# Altium schematic sheet Sheet2.SchDoc
size Letter; SheetNumber: 1; SheetTotal: 1; SPICEModelCacheTXCXQLUS: <root> / <DocumentId>TXCXQLUS</DocumentId> / <CacheFrame Number="0"> / <Model Name="led1" Kind="MDL"> / <Text>*Typ RED GaAs LED: Vf=1.7V Vr=4V If=40mA trr=3uS / *LED Pinout: 1=A, 2=K / .MODEL LED1 D (IS=93.2P RS=42M N=3.73 BV=4 IBV=10U / + CJO=2.97P VJ=.75 M=.333 TT=4.32U)</Text> / </Model> / </CacheFrame> / </root>
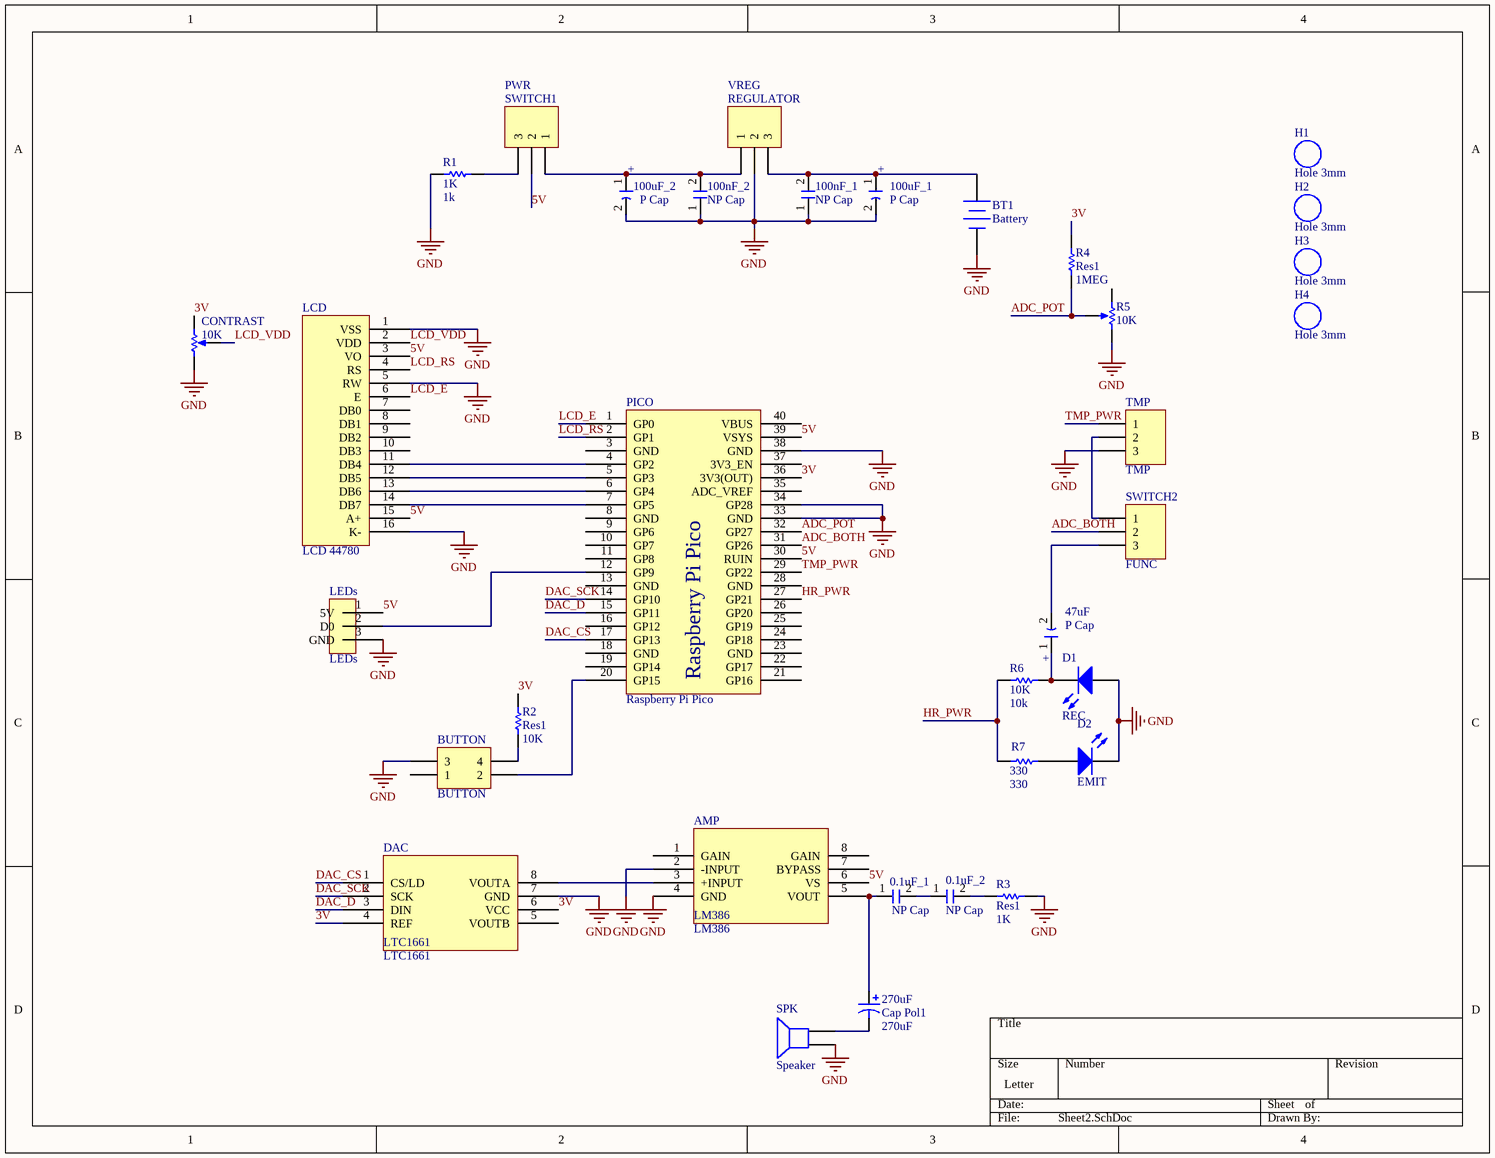
[diagram p0: Sheet2.SchDoc]

## Parts
0.1uF_1  NP Cap  [NP Cap - Small]
0.1uF_2  NP Cap  [NP Cap - Small]
47uF  P Cap  [P Cap - Small]
100nF_1  NP Cap  [NP Cap - Small]
100nF_2  NP Cap  [NP Cap - Small]
100uF_1  P Cap  [P Cap - Small]
100uF_2  P Cap  [P Cap - Small]
270uF  Cap Pol1  value 270uF  [RB7.6-15]
AMP  LM386  [8DIP]
BT1  Battery  [BAT-2]
BUTTON  BUTTON  [HDR2X2]
CONTRAST  value 10K  [POT OFFSET 200]  (hidden comment: RPot_3)
D1  REC  [LED-1]
D2  EMIT  [LED-1]
DAC  LTC1661  [8DIP]
H1  Hole 3mm  [Hole 3mm]
H2  Hole 3mm  [Hole 3mm]
H3  Hole 3mm  [Hole 3mm]
H4  Hole 3mm  [Hole 3mm]
LCD  LCD 44780  [OLED 16x2]
LEDs  LEDs  [RGB LED Port]
PICO  Raspberry Pi Pico  [Raspberry Pi Pico]
R1  1K  [AXIAL-0.3]
R2  Res1  value 10K  [AXIAL-0.3]
R3  Res1  value 1K  [AXIAL-0.3]
R4  Res1  value 1MEG  [AXIAL-0.3]
R5  value 10K  [POT OFFSET 200]  (hidden comment: RPot_3)
R6  10K  [AXIAL-0.3]
R7  330  [AXIAL-0.3]
REGULATOR  VREG  [HDR1X3]
SPK  Speaker  [PIN2]
SWITCH1  PWR  [HDR1X3]
SWITCH2  FUNC  [HDR1X3]
TMP  TMP  [HDR1X3]

## Nets
GND: 100nF_1.1 100nF_2.1 100uF_1.2 100uF_2.2 AMP.2(-INPUT) AMP.4(GND) BT1.2(-) BUTTON.3 CONTRAST.1(TOP) D1.1(A) D2.2(K) DAC.7(GND) LCD.1(VSS) LCD.5(RW) LCD.16(K-) LEDs.3(GND) PICO.33(GND) PICO.34(GP28) PICO.38(GND) R1.1 R3.1 R5.3(BOT) REGULATOR.2 SPK.2 TMP.3
3V: CONTRAST.3(BOT) DAC.4(REF) DAC.6(VCC) PICO.36(3V3(OUT)) R2.2 R4.1
5V: AMP.6(VS) LCD.3(VO) LCD.15(A+) LEDs.1(5V) PICO.30(RUIN) PICO.39(VSYS) SWITCH1.2
ADC_BOTH: PICO.31(GP26) SWITCH2.2
ADC_POT: PICO.32(GP27) R4.2 R5.2(TAP)
DAC_CS: DAC.1(CS/LD) PICO.17(GP13)
DAC_D: DAC.3(DIN) PICO.15(GP11)
DAC_SCK: DAC.2(SCK) PICO.14(GP10)
HR_PWR: PICO.27(GP21) R6.2 R7.2
LCD_E: LCD.6(E) PICO.1(GP0)
LCD_RS: LCD.4(RS) PICO.2(GP1)
LCD_VDD: CONTRAST.2(TAP) LCD.2(VDD)
TMP_PWR: PICO.29(GP22) TMP.1
Net0.1uF_1_1: 0.1uF_1.1 270uF.1 AMP.5(VOUT)
Net0.1uF_1_2: 0.1uF_1.2 0.1uF_2.1
Net0.1uF_2_2: 0.1uF_2.2 R3.2
Net47uF_1: 47uF.1 D1.2(K) R6.1
Net47uF_2: 47uF.2 SWITCH2.3
Net100nF_1_2: 100nF_1.2 100uF_1.1 BT1.1(+) REGULATOR.3
Net100nF_2_2: 100nF_2.2 100uF_2.1 REGULATOR.1 SWITCH1.1
Net270uF_2: 270uF.2 SPK.1
NetAMP_3: AMP.3(+INPUT) DAC.8(VOUTA)
NetBUTTON_2: BUTTON.2 PICO.20(GP15)
NetBUTTON_4: BUTTON.4 R2.1
NetD2_1: D2.1(A) R7.1
NetLCD_11: LCD.11(DB4) PICO.4(GP2)
NetLCD_12: LCD.12(DB5) PICO.5(GP3)
NetLCD_13: LCD.13(DB6) PICO.6(GP4)
NetLCD_14: LCD.14(DB7) PICO.7(GP5)
NetLEDs_2: LEDs.2(D0) PICO.12(GP9)
NetR1_2: R1.2 SWITCH1.3
NetSWITCH2_1: SWITCH2.1 TMP.2

Not connected (* = marked no-connect by the designer): AMP 1(GAIN) 7(BYPASS) 8(GAIN); BUTTON 1; DAC 5(VOUTB); LCD 7(DB0) 8(DB1) 9(DB2) 10(DB3); PICO 3(GND) 8(GND) 9(GP6) 10(GP7) 11(GP8) 13(GND) 16(GP12) 18(GND) 19(GP14) 21(GP16) 22(GP17) 23(GND) 24(GP18) 25(GP19) 26(GP20) 28(GND) 35(ADC_VREF) 37(3V3_EN) 40(VBUS); R5 1(TOP)

## Notes on the sheet
- (in symbol P Cap) +

## Library data of the parts
270uF = Cap Pol1: Polarized Capacitor (Radial); Published: 8-Jun-2000; LatestRevisionDate: 17-Jul-2002; LatestRevisionNote: Re-released for DXP Platform.; PackageReference: RB7.6-15; Publisher: Altium Limited; PackageDescription: Polarized Capacitor (Radial); 2 Leads
BT1 = Battery: Multicell Battery; Published: 24-Mar-1999; LatestRevisionDate: 17-Jul-2002; LatestRevisionNote: Re-released for DXP Platform.; PackageReference: BAT-2; Publisher: Altium Limited; PackageDescription: Battery; 2 Leads
BUTTON = Header 2X2: Header, 2-Pin, Dual row; LatestRevisionDate: 17-Jul-2002; LatestRevisionNote: Re-released for DXP Platform.; Publisher: Altium Limited
CONTRAST R5 = RPot: Potentiometer; Sim Note: Enter the Resistance value and the set point into parameter fields.; Set Position: 0.5; Published: 8-Jun-2000; LatestRevisionDate: 17-Jul-2002; LatestRevisionNote: Re-released for DXP Platform.; Publisher: Altium Limited
D1 D2 = LED1: Typical RED GaAs LED; Published: 8-Jun-2000; LatestRevisionDate: 08-Jul-2005; LatestRevisionNote: Mech Layer 1 removed.; PackageReference: LED-1; Publisher: Altium Limited; PackageDescription: LED; 2 Leads
LEDs = RGB LED Header
R1-R4 R6 R7 = Res1: Resistor; Published: 8-Jun-2000; LatestRevisionDate: 17-Jul-2002; LatestRevisionNote: Re-released for DXP Platform.; PackageReference: AXIAL-0.3; Publisher: Altium Limited; PackageDescription: Axial Device, Thru-Hole; 2 Leads; 0.3 in Pin Spacing
  R1: Value: 1k
  R6: Value: 10k
  R7: Value: 330
REGULATOR SWITCH1 SWITCH2 TMP = Header 3: Header, 3-Pin; LatestRevisionDate: 17-Jul-2002; LatestRevisionNote: Re-released for DXP Platform.; Publisher: Altium Limited
SPK = Speaker: Loudspeaker; Published: 24-Mar-1999; LatestRevisionDate: 17-Jul-2002; LatestRevisionNote: Re-released for DXP Platform.; PackageReference: PIN2; Publisher: Altium Limited